# Altium schematic sheet adc.SchDoc
size 297 x 209 mm
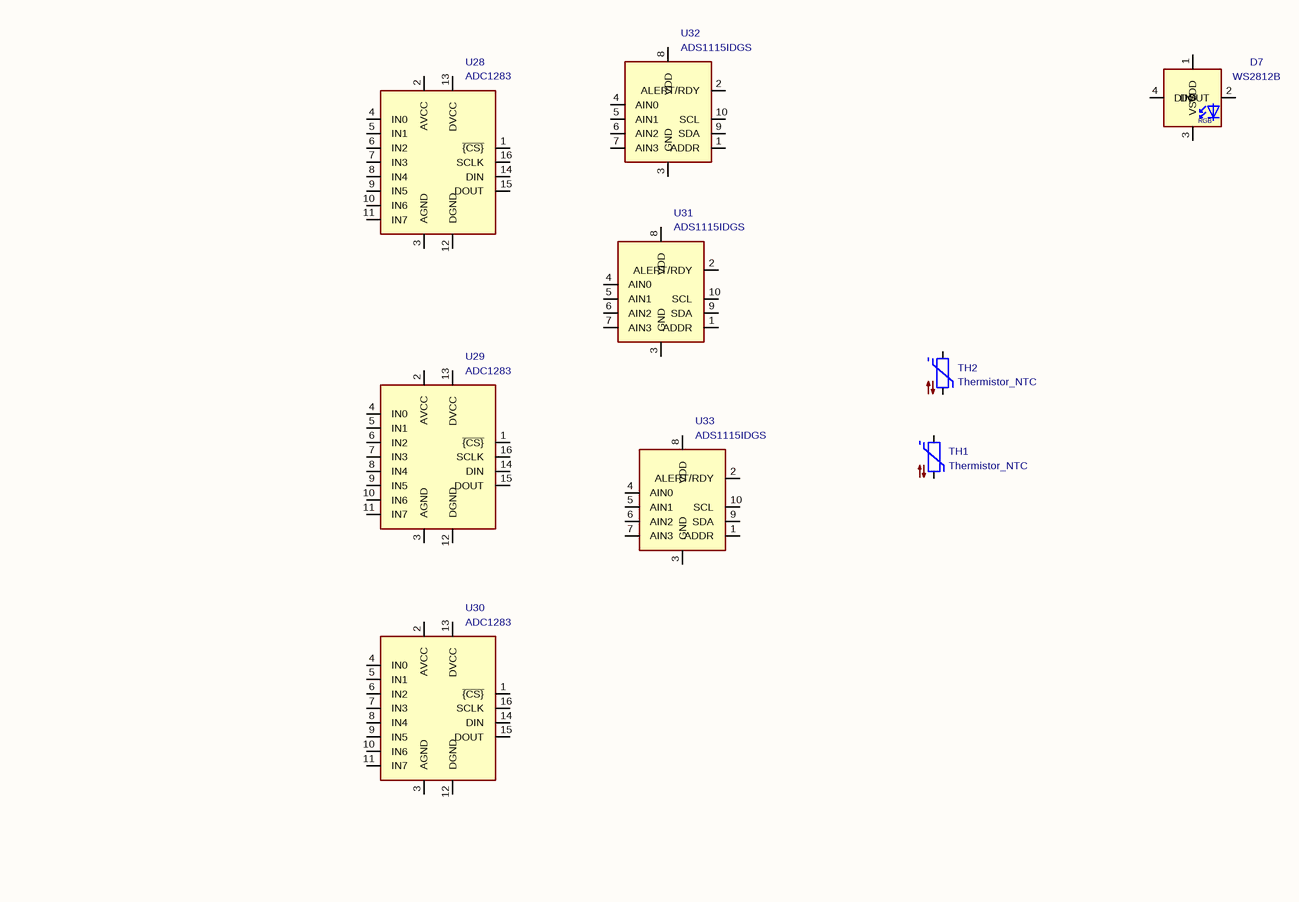
[diagram p0: adc.SchDoc]

## Parts
D7  WS2812B  [LED_WS2812B_PLCC4_5.0x5.0mm_P3.2mm]
TH1  Thermistor_NTC
TH2  Thermistor_NTC
U28  ADC1283  [TSSOP-16_4.4x5mm_P0.65mm]
U29  ADC1283  [TSSOP-16_4.4x5mm_P0.65mm]
U30  ADC1283  [TSSOP-16_4.4x5mm_P0.65mm]
U31  ADS1115IDGS  [TSSOP-10_3x3mm_P0.5mm]
U32  ADS1115IDGS  [TSSOP-10_3x3mm_P0.5mm]
U33  ADS1115IDGS  [TSSOP-10_3x3mm_P0.5mm]

## Nets

Not connected (* = marked no-connect by the designer): D7 1(VDD) 2(DOUT) 3(VSS) 4(DIN); TH1 1 2; TH2 1 2; U28 1(~{{CS}}) 2(AVCC) 3(AGND) 4(IN0) 5(IN1) 6(IN2) 7(IN3) 8(IN4) 9(IN5) 10(IN6) 11(IN7) 12(DGND) 13(DVCC) 14(DIN) 15(DOUT) 16(SCLK); U29 1(~{{CS}}) 2(AVCC) 3(AGND) 4(IN0) 5(IN1) 6(IN2) 7(IN3) 8(IN4) 9(IN5) 10(IN6) 11(IN7) 12(DGND) 13(DVCC) 14(DIN) 15(DOUT) 16(SCLK); U30 1(~{{CS}}) 2(AVCC) 3(AGND) 4(IN0) 5(IN1) 6(IN2) 7(IN3) 8(IN4) 9(IN5) 10(IN6) 11(IN7) 12(DGND) 13(DVCC) 14(DIN) 15(DOUT) 16(SCLK); U31 1(ADDR) 2(ALERT/RDY) 3(GND) 4(AIN0) 5(AIN1) 6(AIN2) 7(AIN3) 8(VDD) 9(SDA) 10(SCL); U32 1(ADDR) 2(ALERT/RDY) 3(GND) 4(AIN0) 5(AIN1) 6(AIN2) 7(AIN3) 8(VDD) 9(SDA) 10(SCL); U33 1(ADDR) 2(ALERT/RDY) 3(GND) 4(AIN0) 5(AIN1) 6(AIN2) 7(AIN3) 8(VDD) 9(SDA) 10(SCL)

## Notes on the sheet
- 1
- 2
- 3
- 4
- 5
- 6
- A
- B
- C
- D
- Title:
- File: adc.kicad_sch
- Sheet: /
- KiCad E.D.A.  kicad (5.1.4)-1
- Size: A4
- Date:
- Rev:
- Id: 1/1
- (in symbol WS2812B) RGB

## Library data of the parts
D7 = WS2812B: Description: RGB LED with integrated controller; Value: WS2812B; Footprint: LED_SMD:LED_WS2812B_PLCC4_5.0x5.0mm_P3.2mm
TH1 TH2 = Thermistor_NTC: Description: Temperature dependent resistor, negative temperature coefficient; Value: Thermistor_NTC
U28-U30 = ADC1283: Description: Low power 8-channel single ended 12-bit SAR ADC, 50 ksps to 200 ksps, SPI, TSSOP-16; Value: ADC1283; Footprint: Package_SO:TSSOP-16_4.4x5mm_P0.65mm
U31-U33 = ADS1115IDGS: Description: Ultra-Small, Low-Power, I2C-Compatible, 860-SPS, 16-Bit ADCs With Internal Reference, Oscillator, and Programmable Comparator, VSSOP-10; Value: ADS1115IDGS; Footprint: Package_SO:TSSOP-10_3x3mm_P0.5mm